# Altium schematic sheet MOSFETs.SchDoc
size A3
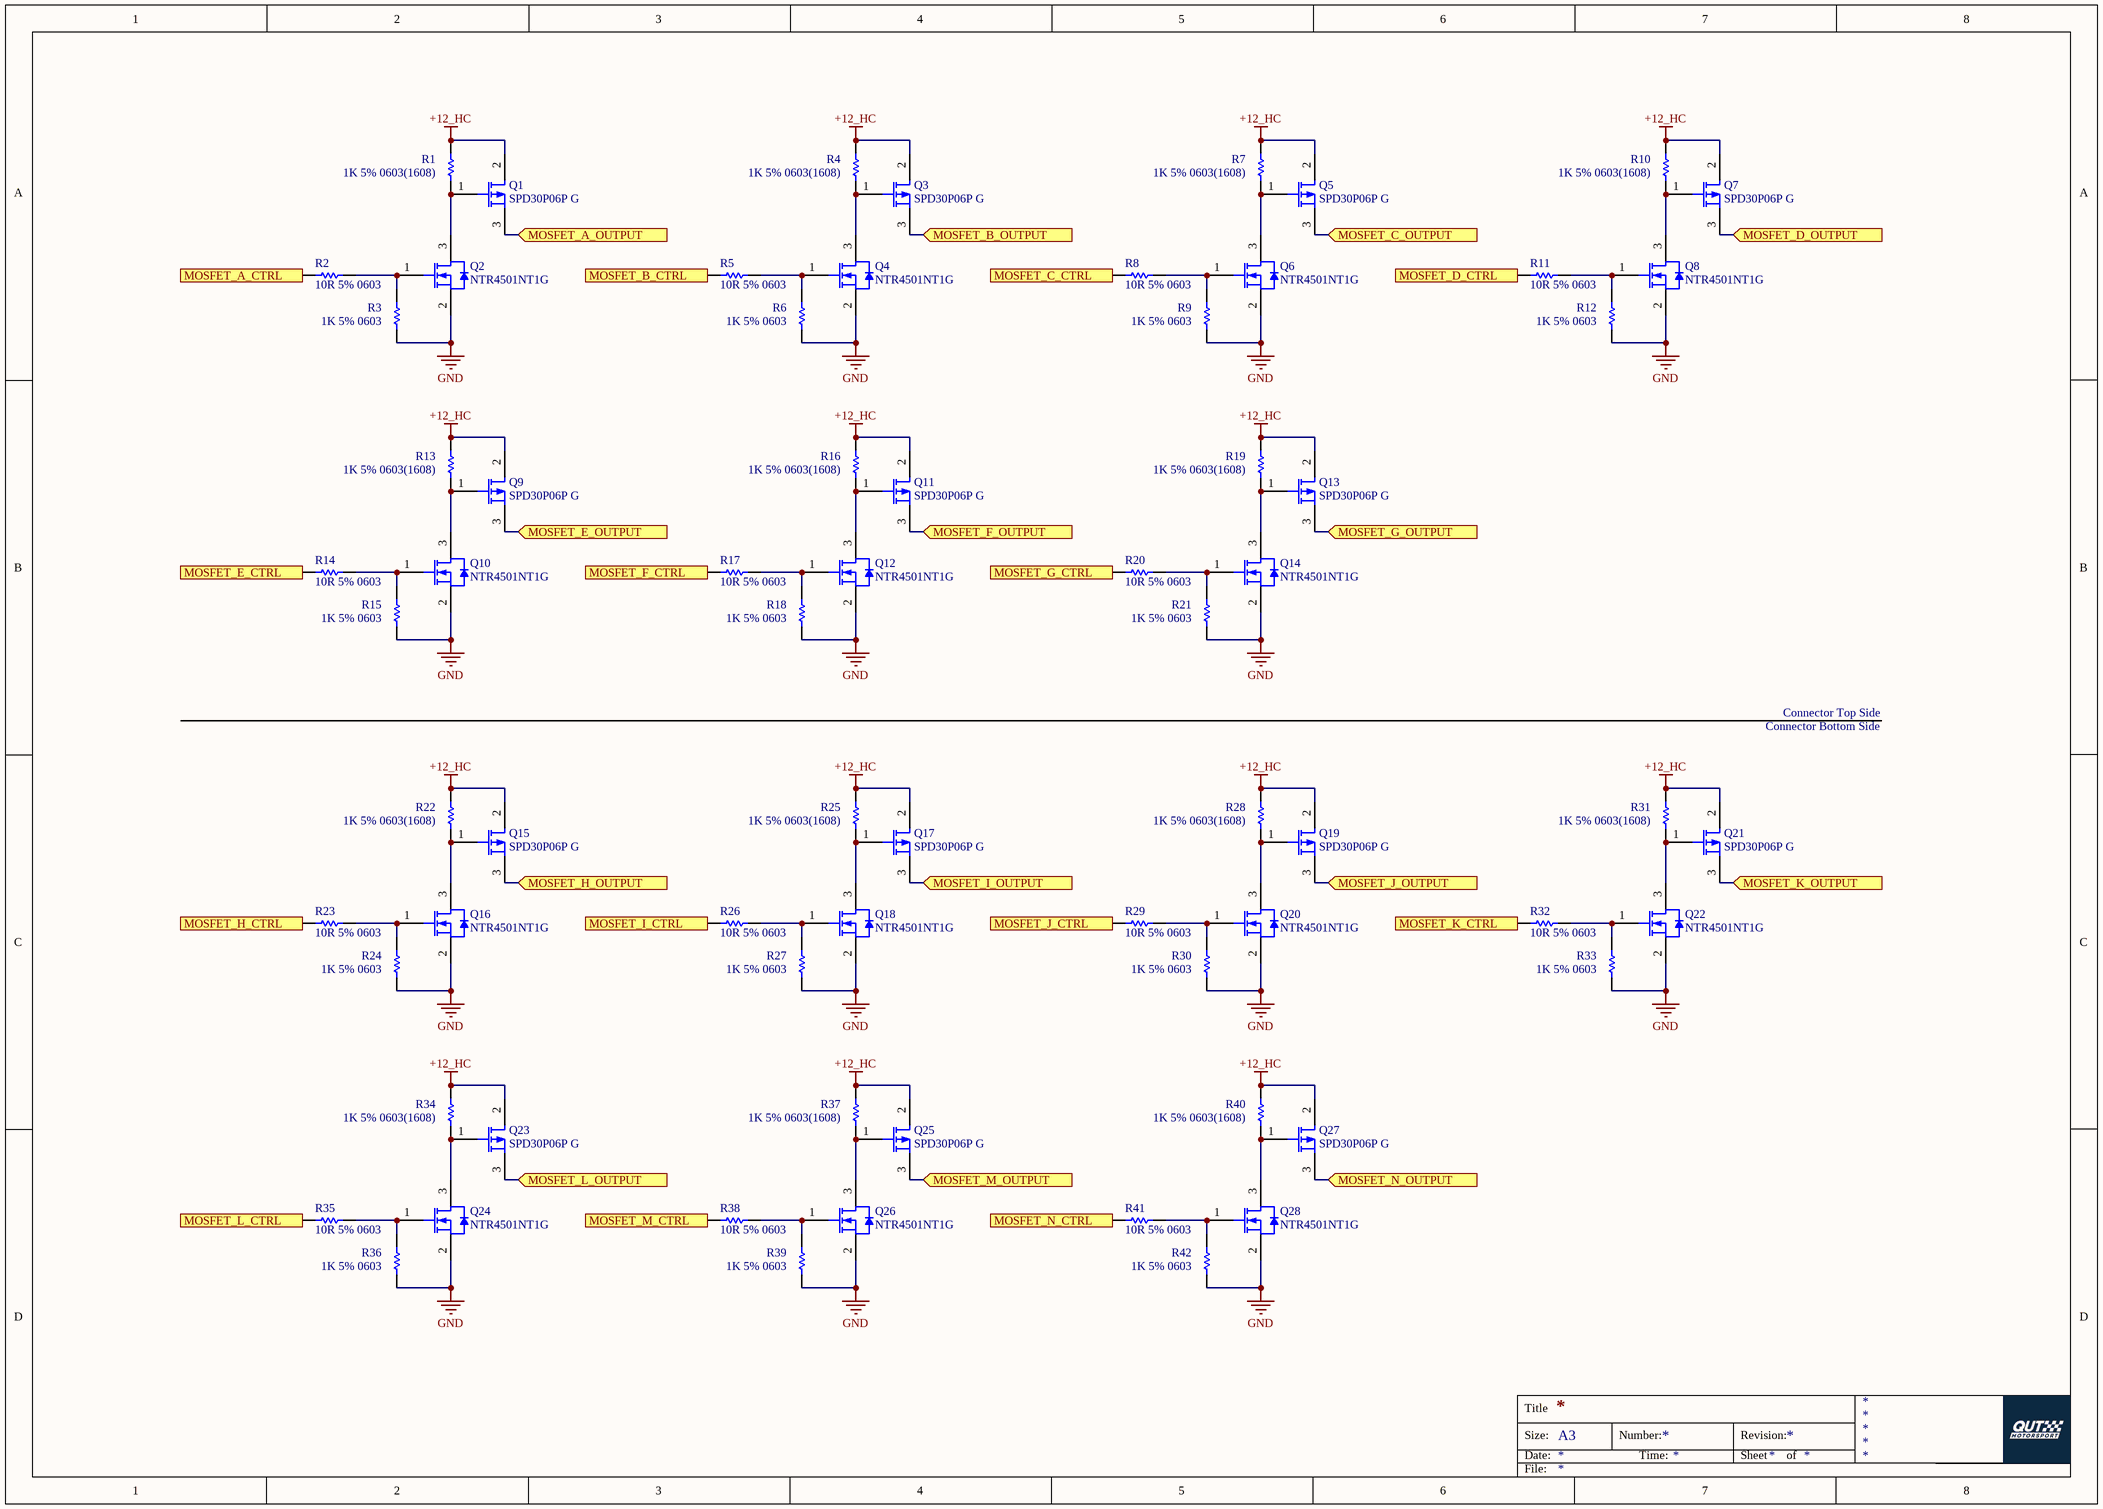
[diagram p0: MOSFETs.SchDoc]

## Parts
Q1  SPD30P06P G  [INF-PG-TO252-3-1_N]
Q2  NTR4501NT1G  [ONSC-SOT-23-3-318-08_V]
Q3  SPD30P06P G  [INF-PG-TO252-3-1_N]
Q4  NTR4501NT1G  [ONSC-SOT-23-3-318-08_V]
Q5  SPD30P06P G  [INF-PG-TO252-3-1_N]
Q6  NTR4501NT1G  [ONSC-SOT-23-3-318-08_V]
Q7  SPD30P06P G  [INF-PG-TO252-3-1_N]
Q8  NTR4501NT1G  [ONSC-SOT-23-3-318-08_V]
Q9  SPD30P06P G  [INF-PG-TO252-3-1_N]
Q10  NTR4501NT1G  [ONSC-SOT-23-3-318-08_V]
Q11  SPD30P06P G  [INF-PG-TO252-3-1_N]
Q12  NTR4501NT1G  [ONSC-SOT-23-3-318-08_V]
Q13  SPD30P06P G  [INF-PG-TO252-3-1_N]
Q14  NTR4501NT1G  [ONSC-SOT-23-3-318-08_V]
Q15  SPD30P06P G  [INF-PG-TO252-3-1_N]
Q16  NTR4501NT1G  [ONSC-SOT-23-3-318-08_V]
Q17  SPD30P06P G  [INF-PG-TO252-3-1_N]
Q18  NTR4501NT1G  [ONSC-SOT-23-3-318-08_V]
Q19  SPD30P06P G  [INF-PG-TO252-3-1_N]
Q20  NTR4501NT1G  [ONSC-SOT-23-3-318-08_V]
Q21  SPD30P06P G  [INF-PG-TO252-3-1_N]
Q22  NTR4501NT1G  [ONSC-SOT-23-3-318-08_V]
Q23  SPD30P06P G  [INF-PG-TO252-3-1_N]
Q24  NTR4501NT1G  [ONSC-SOT-23-3-318-08_V]
Q25  SPD30P06P G  [INF-PG-TO252-3-1_N]
Q26  NTR4501NT1G  [ONSC-SOT-23-3-318-08_V]
Q27  SPD30P06P G  [INF-PG-TO252-3-1_N]
Q28  NTR4501NT1G  [ONSC-SOT-23-3-318-08_V]
R1  1K 5% 0603(1608)  [RESC0603(1608)_L]
R2  10R 5% 0603  [RESC0603(1608)_L]
R3  1K 5% 0603  [RESC0603(1608)_L]
R4  1K 5% 0603(1608)  [RESC0603(1608)_L]
R5  10R 5% 0603  [RESC0603(1608)_L]
R6  1K 5% 0603  [RESC0603(1608)_L]
R7  1K 5% 0603(1608)  [RESC0603(1608)_L]
R8  10R 5% 0603  [RESC0603(1608)_L]
R9  1K 5% 0603  [RESC0603(1608)_L]
R10  1K 5% 0603(1608)  [RESC0603(1608)_L]
R11  10R 5% 0603  [RESC0603(1608)_L]
R12  1K 5% 0603  [RESC0603(1608)_L]
R13  1K 5% 0603(1608)  [RESC0603(1608)_L]
R14  10R 5% 0603  [RESC0603(1608)_L]
R15  1K 5% 0603  [RESC0603(1608)_L]
R16  1K 5% 0603(1608)  [RESC0603(1608)_L]
R17  10R 5% 0603  [RESC0603(1608)_L]
R18  1K 5% 0603  [RESC0603(1608)_L]
R19  1K 5% 0603(1608)  [RESC0603(1608)_L]
R20  10R 5% 0603  [RESC0603(1608)_L]
R21  1K 5% 0603  [RESC0603(1608)_L]
R22  1K 5% 0603(1608)  [RESC0603(1608)_L]
R23  10R 5% 0603  [RESC0603(1608)_L]
R24  1K 5% 0603  [RESC0603(1608)_L]
R25  1K 5% 0603(1608)  [RESC0603(1608)_L]
R26  10R 5% 0603  [RESC0603(1608)_L]
R27  1K 5% 0603  [RESC0603(1608)_L]
R28  1K 5% 0603(1608)  [RESC0603(1608)_L]
R29  10R 5% 0603  [RESC0603(1608)_L]
R30  1K 5% 0603  [RESC0603(1608)_L]
R31  1K 5% 0603(1608)  [RESC0603(1608)_L]
R32  10R 5% 0603  [RESC0603(1608)_L]
R33  1K 5% 0603  [RESC0603(1608)_L]
R34  1K 5% 0603(1608)  [RESC0603(1608)_L]
R35  10R 5% 0603  [RESC0603(1608)_L]
R36  1K 5% 0603  [RESC0603(1608)_L]
R37  1K 5% 0603(1608)  [RESC0603(1608)_L]
R38  10R 5% 0603  [RESC0603(1608)_L]
R39  1K 5% 0603  [RESC0603(1608)_L]
R40  1K 5% 0603(1608)  [RESC0603(1608)_L]
R41  10R 5% 0603  [RESC0603(1608)_L]
R42  1K 5% 0603  [RESC0603(1608)_L]

## Ports
MOSFET_A_CTRL (out), MOSFET_A_OUTPUT (in), MOSFET_B_CTRL (out), MOSFET_B_OUTPUT (in), MOSFET_C_CTRL (out), MOSFET_C_OUTPUT (in), MOSFET_D_CTRL (out), MOSFET_D_OUTPUT (in), MOSFET_E_CTRL (out), MOSFET_E_OUTPUT (in), MOSFET_F_CTRL (out), MOSFET_F_OUTPUT (in), MOSFET_G_CTRL (out), MOSFET_G_OUTPUT (in), MOSFET_H_CTRL (out), MOSFET_H_OUTPUT (in), MOSFET_I_CTRL (out), MOSFET_I_OUTPUT (in), MOSFET_J_CTRL (out), MOSFET_J_OUTPUT (in), MOSFET_K_CTRL (out), MOSFET_K_OUTPUT (in), MOSFET_L_CTRL (out), MOSFET_L_OUTPUT (in), MOSFET_M_CTRL (out), MOSFET_M_OUTPUT (in), MOSFET_N_CTRL (out), MOSFET_N_OUTPUT (in)

## Nets
+12_HC: Q1.2(D) Q3.2(D) Q5.2(D) Q7.2(D) Q9.2(D) Q11.2(D) Q13.2(D) Q15.2(D) Q17.2(D) Q19.2(D) Q21.2(D) Q23.2(D) Q25.2(D) Q27.2(D) R1.2 R4.2 R7.2 R10.2 R13.2 R16.2 R19.2 R22.2 R25.2 R28.2 R31.2 R34.2 R37.2 R40.2
GND: Q2.2(S) Q4.2(S) Q6.2(S) Q8.2(S) Q10.2(S) Q12.2(S) Q14.2(S) Q16.2(S) Q18.2(S) Q20.2(S) Q22.2(S) Q24.2(S) Q26.2(S) Q28.2(S) R3.1 R6.1 R9.1 R12.1 R15.1 R18.1 R21.1 R24.1 R27.1 R30.1 R33.1 R36.1 R39.1 R42.1
MOSFET_A_CTRL: R2.2 ; port MOSFET_A_CTRL
MOSFET_A_OUTPUT: Q1.3(S) ; port MOSFET_A_OUTPUT
MOSFET_B_CTRL: R5.2 ; port MOSFET_B_CTRL
MOSFET_B_OUTPUT: Q3.3(S) ; port MOSFET_B_OUTPUT
MOSFET_C_CTRL: R8.2 ; port MOSFET_C_CTRL
MOSFET_C_OUTPUT: Q5.3(S) ; port MOSFET_C_OUTPUT
MOSFET_D_CTRL: R11.2 ; port MOSFET_D_CTRL
MOSFET_D_OUTPUT: Q7.3(S) ; port MOSFET_D_OUTPUT
MOSFET_E_CTRL: R14.2 ; port MOSFET_E_CTRL
MOSFET_E_OUTPUT: Q9.3(S) ; port MOSFET_E_OUTPUT
MOSFET_F_CTRL: R17.2 ; port MOSFET_F_CTRL
MOSFET_F_OUTPUT: Q11.3(S) ; port MOSFET_F_OUTPUT
MOSFET_G_CTRL: R20.2 ; port MOSFET_G_CTRL
MOSFET_G_OUTPUT: Q13.3(S) ; port MOSFET_G_OUTPUT
MOSFET_H_CTRL: R23.2 ; port MOSFET_H_CTRL
MOSFET_H_OUTPUT: Q15.3(S) ; port MOSFET_H_OUTPUT
MOSFET_I_CTRL: R26.2 ; port MOSFET_I_CTRL
MOSFET_I_OUTPUT: Q17.3(S) ; port MOSFET_I_OUTPUT
MOSFET_J_CTRL: R29.2 ; port MOSFET_J_CTRL
MOSFET_J_OUTPUT: Q19.3(S) ; port MOSFET_J_OUTPUT
MOSFET_K_CTRL: R32.2 ; port MOSFET_K_CTRL
MOSFET_K_OUTPUT: Q21.3(S) ; port MOSFET_K_OUTPUT
MOSFET_L_CTRL: R35.2 ; port MOSFET_L_CTRL
MOSFET_L_OUTPUT: Q23.3(S) ; port MOSFET_L_OUTPUT
MOSFET_M_CTRL: R38.2 ; port MOSFET_M_CTRL
MOSFET_M_OUTPUT: Q25.3(S) ; port MOSFET_M_OUTPUT
MOSFET_N_CTRL: R41.2 ; port MOSFET_N_CTRL
MOSFET_N_OUTPUT: Q27.3(S) ; port MOSFET_N_OUTPUT
NetQ1_1: Q1.1(G) Q2.3(D) R1.1
NetQ2_1: Q2.1(G) R2.1 R3.2
NetQ3_1: Q3.1(G) Q4.3(D) R4.1
NetQ4_1: Q4.1(G) R5.1 R6.2
NetQ5_1: Q5.1(G) Q6.3(D) R7.1
NetQ6_1: Q6.1(G) R8.1 R9.2
NetQ7_1: Q7.1(G) Q8.3(D) R10.1
NetQ8_1: Q8.1(G) R11.1 R12.2
NetQ9_1: Q9.1(G) Q10.3(D) R13.1
NetQ10_1: Q10.1(G) R14.1 R15.2
NetQ11_1: Q11.1(G) Q12.3(D) R16.1
NetQ12_1: Q12.1(G) R17.1 R18.2
NetQ13_1: Q13.1(G) Q14.3(D) R19.1
NetQ14_1: Q14.1(G) R20.1 R21.2
NetQ15_1: Q15.1(G) Q16.3(D) R22.1
NetQ16_1: Q16.1(G) R23.1 R24.2
NetQ17_1: Q17.1(G) Q18.3(D) R25.1
NetQ18_1: Q18.1(G) R26.1 R27.2
NetQ19_1: Q19.1(G) Q20.3(D) R28.1
NetQ20_1: Q20.1(G) R29.1 R30.2
NetQ21_1: Q21.1(G) Q22.3(D) R31.1
NetQ22_1: Q22.1(G) R32.1 R33.2
NetQ23_1: Q23.1(G) Q24.3(D) R34.1
NetQ24_1: Q24.1(G) R35.1 R36.2
NetQ25_1: Q25.1(G) Q26.3(D) R37.1
NetQ26_1: Q26.1(G) R38.1 R39.2
NetQ27_1: Q27.1(G) Q28.3(D) R40.1
NetQ28_1: Q28.1(G) R41.1 R42.2

## Notes on the sheet
- Connector Top Side
- Connector Bottom Side
- Title
- Size:
- Date:
- A3
- Number:
- Time:
- Revision:
- Sheet
- of
- File:

## Library data of the parts
Q1 Q3 Q5 Q7 Q9 Q11 Q13 Q15 Q17 Q19 Q21 Q23 Q25 Q27 = CMP-1099-00058-1: P-Channel SIPMOS Power-Transistor, -60 V VDS, -30 A ID, -55 to 175 degC, PG-TO252-3-1, Reel, Green; Manufacturer: Infineon; Pto t (max): 125Â W; RDS (on) (max): 75Â mOhm; VGS(th) (max): -4Â V; Green: TRUE; ID (max): -30Â A; QG: 32Â nC; VDS (max): -60Â V; VGS(th) (min): -2.1Â V; RthJC (max): 1.2Â K/W; IDpuls (max): -120Â A; ComponentLink1Description: Manufacturer URL; Packing: Reel; ComponentLink2Description: Datasheet; ComponentLink1URL: http://www.infineon.com/; ComponentLink3Description: Package Specification; PackageDescription: 3-Pin Plastic (Green) Transistor Single Outline Package, 6.5 x 6.12 mm Body, 2.28 mm Pitch; Mounting Technology: Surface Mount; ComponentLink3URL: http://www.infineon.com/dgdl/TLE42744_DS_11.pdf?folderId=db3a304318f3fe290118f5a433570040&fileId=db3a304327b897500128012ccafe37d2&sId=db3a30443d67b5ca013d83f7c0ea327b; Rth: 1.2Â K/W; ComponentLink2URL: http://www.infineon.com/dgdl/SPD30P06P_Rev.2.3_pdf.pdf?folderId=db3a30431ed1d7b2011f4042f2ff4ec5&fileId=db3a30431ed1d7b2011f404fbc7e4ef4; PartNumber: SPD30P06P G; PackageReference: PG-TO252-3-1; DatasheetVersion: Rev. 2.3; PackageVersion: Jan-10
Q2 Q4 Q6 Q8 Q10 Q12 Q14 Q16 Q18 Q20 Q22 Q24 Q26 Q28 = CMP-1058-00732-1: Power MOSFET, 20 V, 3.2 A, Single N-Channel, 3-Pin SOT-23, Pb-Free, Tape and Reel; Manufacturer: On Semiconductor; VGS Max (V): 12; VGS(th) Max (V): 1.2; PD Max (W): 1.25; Coss Typ (pF): 80; Ciss Typ (pF): 200; V(BR)DSS Min (V): 20; Qrr Typ (nC): 3; Crss Typ (pF): 50; Channel Polarity: N Channel; RoHS: Pb-Free; ComponentLink3URL: http://www.onsemi.cn/pub_link/Collateral/318-08.PDF; ComponentLink2Description: Datasheet; PackageVersion: Rev. AP, 11/2009; Mounting Technology: Surface Mount; PackageDescription: 3-Pin Small Outline Transistor, Body 2.92 x 1.3 mm, Pitch 0.95 mm; PackageReference: SOT-23-3-318-08; ComponentLink1URL: http://www.onsemi.com/; Packing: Tape and Reel; Configuration: Single; ComponentLink2URL: http://www.onsemi.cn/pub_link/Collateral/NTR4501N-D.PDF; ComponentLink3Description: Package Specification; Package Type: SOT-23-3; ComponentLink1Description: Manufacturer URL; PartNumber: NTR4501NT1G; DatasheetVersion: Rev. 13
R1 R3 R4 R6 R7 R9 R10 R12 R13 R15 R16 R18 R19 R21 R22 R24 R25 R27 R28 R30 R31 R33 R34 R36 R37 R39 R40 R42 = CMP-1012-00074-1: 1K 0.1W 5% 0603 (1608 Metric)  SMD; Case-EIA: 0603; Case-Metric: 1608; Value: 1000.00 Ohm; Technology: SMT; Tolerance: 5 %; Power: 0.1 W
R2 R5 R8 R11 R14 R17 R20 R23 R26 R29 R32 R35 R38 R41 = CMP-1012-00026-1: 10R 0.1W 5% 0603 (1608 Metric)  SMD; Case-Metric: 1608; Case-EIA: 0603; Value: 10.00 Ohm; Technology: SMT; Tolerance: 5 %; Power: 0.1 W